# Altium schematic sheet ESP32.SchDoc: Microcontrolador
size A4; Author: Matias Herrera
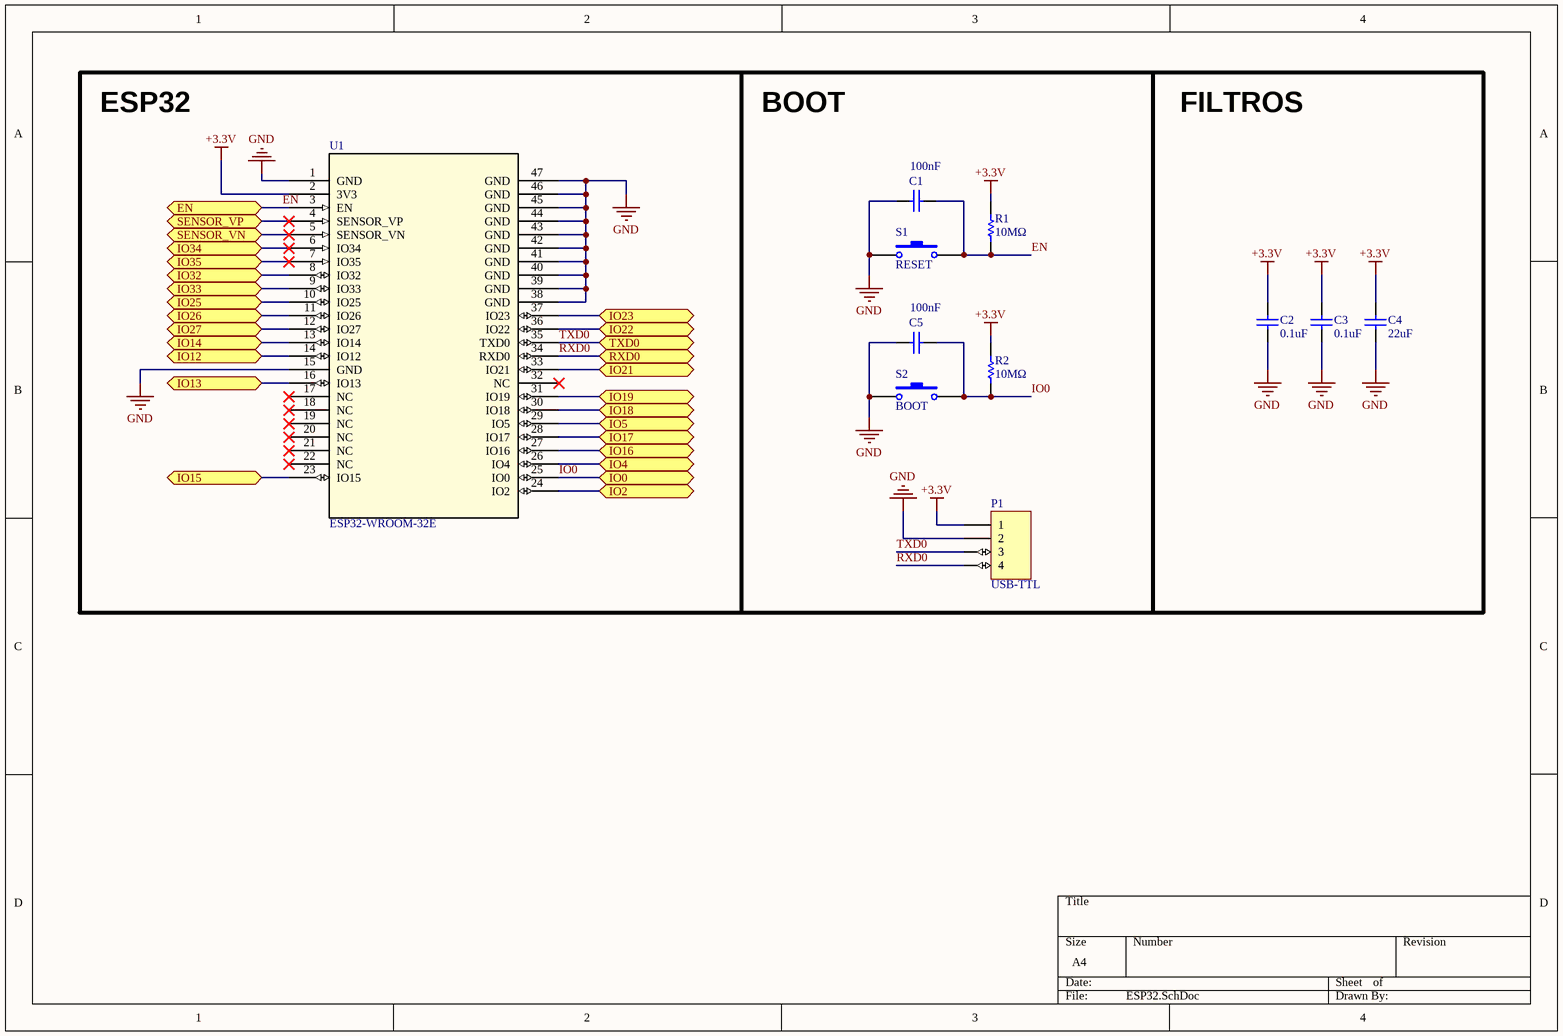
[diagram p0: ESP32.SchDoc]

## Parts
C1  100nF  [CAPC2012N]
C2  0.1uF  [CAPC2012N]
C3  0.1uF  [CAPC2012N]
C4  22uF  [CAPC2012N]
C5  100nF  [CAPC2012N]
P1  USB-TTL  [CONNHDR_1X4_2.54MM]
R1  10MΩ  [RESC2012N]
R2  10MΩ  [RESC2012N]
S1  RESET  [SWITCH TACTILE SPST-NO 0.05A 12V]
S2  BOOT  [SWITCH TACTILE SPST-NO 0.05A 12V]
U1  ESP32-WROOM-32E  [ESP32-WROOM-32E]

## Ports
EN (bidir), IO0 (bidir), IO2 (bidir), IO4 (bidir), IO5 (bidir), IO12 (bidir), IO13 (bidir), IO14 (bidir), IO15 (bidir), IO16 (bidir), IO17 (bidir), IO18 (bidir), IO19 (bidir), IO21 (bidir), IO22 (bidir), IO23 (bidir), IO25 (bidir), IO26 (bidir), IO27 (bidir), IO32 (bidir), IO33 (bidir), IO34 (bidir), IO35 (bidir), RXD0 (bidir), SENSOR_VN (bidir), SENSOR_VP (bidir), TXD0 (bidir)

## Nets
+3.3V: C2.1 C3.1 C4.1 P1.1 R1.2 R2.2 U1.2(3V3)
GND: C1.2 C2.2 C3.2 C4.2 C5.2 P1.2 S1.1 S2.1 U1.1(GND) U1.15(GND) U1.38(GND) U1.39(GND) U1.40(GND) U1.41(GND) U1.42(GND) U1.43(GND) U1.44(GND) U1.45(GND) U1.46(GND) U1.47(GND)
EN: C1.1 R1.1 S1.2 U1.3(EN) ; port EN
IO0: C5.1 R2.1 S2.2 U1.25(IO0) ; port IO0
IO2: U1.24(IO2) ; port IO2
IO4: U1.26(IO4) ; port IO4
IO5: U1.29(IO5) ; port IO5
IO12: U1.14(IO12) ; port IO12
IO13: U1.16(IO13) ; port IO13
IO14: U1.13(IO14) ; port IO14
IO15: U1.23(IO15) ; port IO15
IO16: U1.27(IO16) ; port IO16
IO17: U1.28(IO17) ; port IO17
IO18: U1.30(IO18) ; port IO18
IO19: U1.31(IO19) ; port IO19
IO21: U1.33(IO21) ; port IO21
IO22: U1.36(IO22) ; port IO22
IO23: U1.37(IO23) ; port IO23
IO25: U1.10(IO25) ; port IO25
IO26: U1.11(IO26) ; port IO26
IO27: U1.12(IO27) ; port IO27
IO32: U1.8(IO32) ; port IO32
IO33: U1.9(IO33) ; port IO33
IO34: U1.6(IO34) ; port IO34
IO35: U1.7(IO35) ; port IO35
RXD0: P1.4 U1.34(RXD0) ; port RXD0
SENSOR_VN: U1.5(SENSOR_VN) ; port SENSOR_VN
SENSOR_VP: U1.4(SENSOR_VP) ; port SENSOR_VP
TXD0: P1.3 U1.35(TXD0) ; port TXD0

Not connected (* = marked no-connect by the designer): U1 17(NC)* 18(NC)* 19(NC)* 20(NC)* 21(NC)* 22(NC)* 32(NC)*

## Notes on the sheet
- ESP32
- BOOT
- FILTROS

## Library data of the parts
C1 C5 = Cap: Capacitor; Published: 8-Jun-2000; LatestRevisionDate: 17-Jul-2002; LatestRevisionNote: Re-released for DXP Platform.; PackageReference: RAD-0.3; Publisher: Altium Limited; PackageDescription: Radial Cap, Thru-Hole; 2 Leads; 0.3 in Pin Spacing; Value: 100nF
C2-C4 = Cap: Capacitor; Value: 100pF; Published: 8-Jun-2000; LatestRevisionDate: 17-Jul-2002; LatestRevisionNote: Re-released for DXP Platform.; PackageReference: RAD-0.3; Publisher: Altium Limited; PackageDescription: Radial Cap, Thru-Hole; 2 Leads; 0.3 in Pin Spacing
P1 = MHDR1X4: Header, 4-Pin; LatestRevisionDate: 17-Jul-2002; LatestRevisionNote: Re-released for DXP Platform.; Publisher: Altium Limited
R1 R2 = Res1: Resistor; Value: 1M; Published: 8-Jun-2000; LatestRevisionDate: 17-Jul-2002; LatestRevisionNote: Re-released for DXP Platform.; PackageReference: AXIAL-0.3; Publisher: Altium Limited; PackageDescription: Axial Device, Thru-Hole; 2 Leads; 0.3 in Pin Spacing
S1 S2 = SW-PB: Switch; Published: 24-Mar-1999; LatestRevisionDate: 17-Jul-2002; LatestRevisionNote: Re-released for DXP Platform.; PackageReference: SPST-2; Publisher: Altium Limited; PackageDescription: Switch; 2 Leads